# Altium schematic sheet Main.SchDoc
size A; SheetNumber: 1; SheetTotal: 9
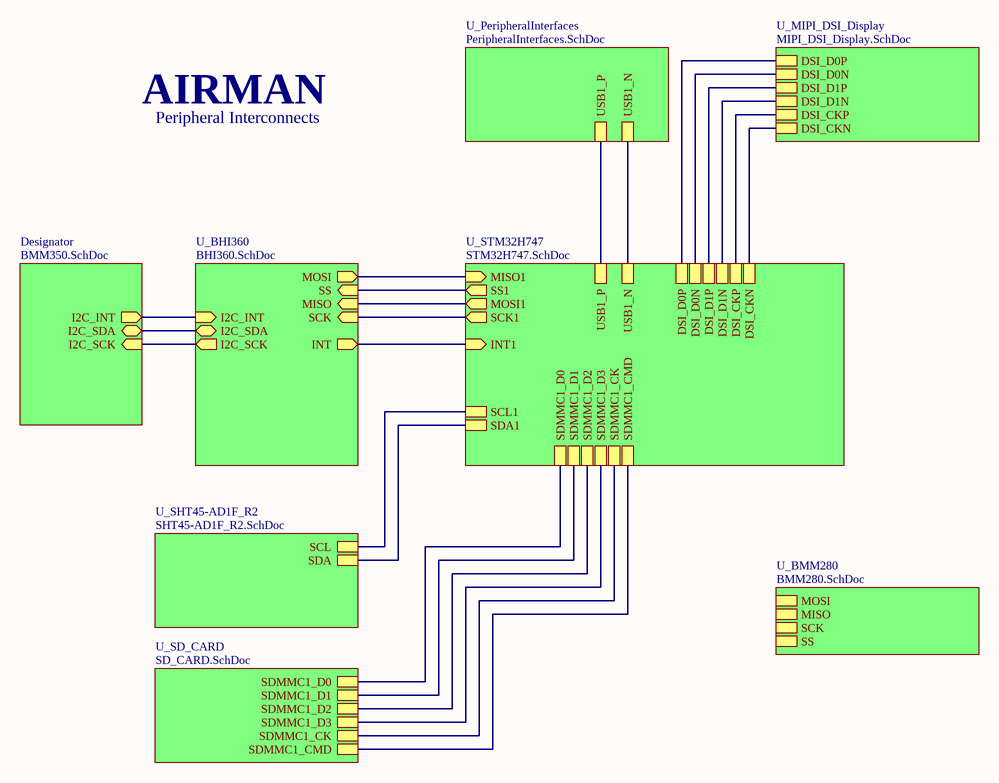
[diagram p0: Main.SchDoc]

## Sub-sheets
Designator = BMM350.SchDoc: I2C_INT (out), I2C_SDA (bidir), I2C_SCK (in)
U_BHI360 = BHI360.SchDoc: MISO (in), MOSI (out), SCK (in), SS (in), I2C_INT (in), I2C_SCK (out), I2C_SDA (bidir), INT (out)
U_BMM280 = BMM280.SchDoc: MOSI, MISO, SCK, SS
U_MIPI_DSI_Display = MIPI_DSI_Display.SchDoc: DSI_D0P, DSI_D0N, DSI_D1P, DSI_D1N, DSI_CKP, DSI_CKN
U_PeripheralInterfaces = PeripheralInterfaces.SchDoc: USB1_P, USB1_N
U_SD_CARD = SD_CARD.SchDoc: SDMMC1_D0, SDMMC1_D1, SDMMC1_D2, SDMMC1_D3, SDMMC1_CK, SDMMC1_CMD
U_SHT45-AD1F_R2 = SHT45-AD1F_R2.SchDoc: SCL, SDA
U_STM32H747 = STM32H747.SchDoc: MOSI1 (out), MISO1 (in), SCK1 (out), SS1 (out), INT1 (in), USB1_P, USB1_N, DSI_D0P, DSI_D0N, DSI_D1P, DSI_D1N, DSI_CKP, DSI_CKN, SCL1, SDA1, SDMMC1_D0, SDMMC1_D1, SDMMC1_D2, SDMMC1_D3, SDMMC1_CK, SDMMC1_CMD

## Nets
(unnamed): sheet U_BHI360/MISO, sheet U_STM32H747/MOSI1
(unnamed): sheet U_BHI360/MOSI, sheet U_STM32H747/MISO1
(unnamed): sheet U_BHI360/SCK, sheet U_STM32H747/SCK1
(unnamed): sheet U_BHI360/SS, sheet U_STM32H747/SS1
(unnamed): sheet U_BHI360/I2C_INT, sheet Designator/I2C_INT
(unnamed): sheet U_BHI360/I2C_SCK, sheet Designator/I2C_SCK
(unnamed): sheet U_BHI360/I2C_SDA, sheet Designator/I2C_SDA
(unnamed): sheet U_BHI360/INT, sheet U_STM32H747/INT1
(unnamed): sheet U_STM32H747/USB1_P, sheet U_PeripheralInterfaces/USB1_P
(unnamed): sheet U_STM32H747/USB1_N, sheet U_PeripheralInterfaces/USB1_N
(unnamed): sheet U_STM32H747/DSI_D0P, sheet U_MIPI_DSI_Display/DSI_D0P
(unnamed): sheet U_STM32H747/DSI_D0N, sheet U_MIPI_DSI_Display/DSI_D0N
(unnamed): sheet U_STM32H747/DSI_D1P, sheet U_MIPI_DSI_Display/DSI_D1P
(unnamed): sheet U_STM32H747/DSI_D1N, sheet U_MIPI_DSI_Display/DSI_D1N
(unnamed): sheet U_STM32H747/DSI_CKP, sheet U_MIPI_DSI_Display/DSI_CKP
(unnamed): sheet U_STM32H747/DSI_CKN, sheet U_MIPI_DSI_Display/DSI_CKN
(unnamed): sheet U_STM32H747/SCL1, sheet U_SHT45-AD1F_R2/SCL
(unnamed): sheet U_STM32H747/SDA1, sheet U_SHT45-AD1F_R2/SDA
(unnamed): sheet U_STM32H747/SDMMC1_D0, sheet U_SD_CARD/SDMMC1_D0
(unnamed): sheet U_STM32H747/SDMMC1_D1, sheet U_SD_CARD/SDMMC1_D1
(unnamed): sheet U_STM32H747/SDMMC1_D2, sheet U_SD_CARD/SDMMC1_D2
(unnamed): sheet U_STM32H747/SDMMC1_D3, sheet U_SD_CARD/SDMMC1_D3
(unnamed): sheet U_STM32H747/SDMMC1_CK, sheet U_SD_CARD/SDMMC1_CK
(unnamed): sheet U_STM32H747/SDMMC1_CMD, sheet U_SD_CARD/SDMMC1_CMD

## Notes on the sheet
- AIRMAN
- Peripheral Interconnects